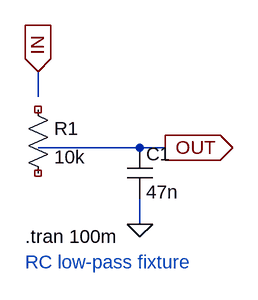
[diagram p0: schematic ltspice-rc-lowpass.asc]
ltspice-rc-lowpass.asc, the LTspice schematic file:
Version 4
SHEET 1 880 680
WIRE 16 -32 16 0
WIRE 16 64 144 64
WIRE 144 64 176 64
WIRE 144 128 144 160
FLAG 16 -32 IN
IOPIN 16 -32 In
FLAG 176 64 OUT
IOPIN 176 64 Out
FLAG 144 160 0
SYMBOL res 0 0 R0
SYMATTR InstName R1
SYMATTR Value 10k
SYMBOL cap 128 64 R0
SYMATTR InstName C1
SYMATTR Value 47n
TEXT 0 176 Left 2 !.tran 100m
TEXT 0 208 Left 2 ;RC low-pass fixture

The netlist it stands for:
* ltspice-rc-lowpass.asc
R1 NC_01 NC_02 10k
C1 OUT 0 47n
.tran 100m
* RC low-pass fixture
.backanno
.end